# Altium schematic sheet PCB 1ST VERSION.SchDoc
size A3; SheetNumber: 1; SheetTotal: 1
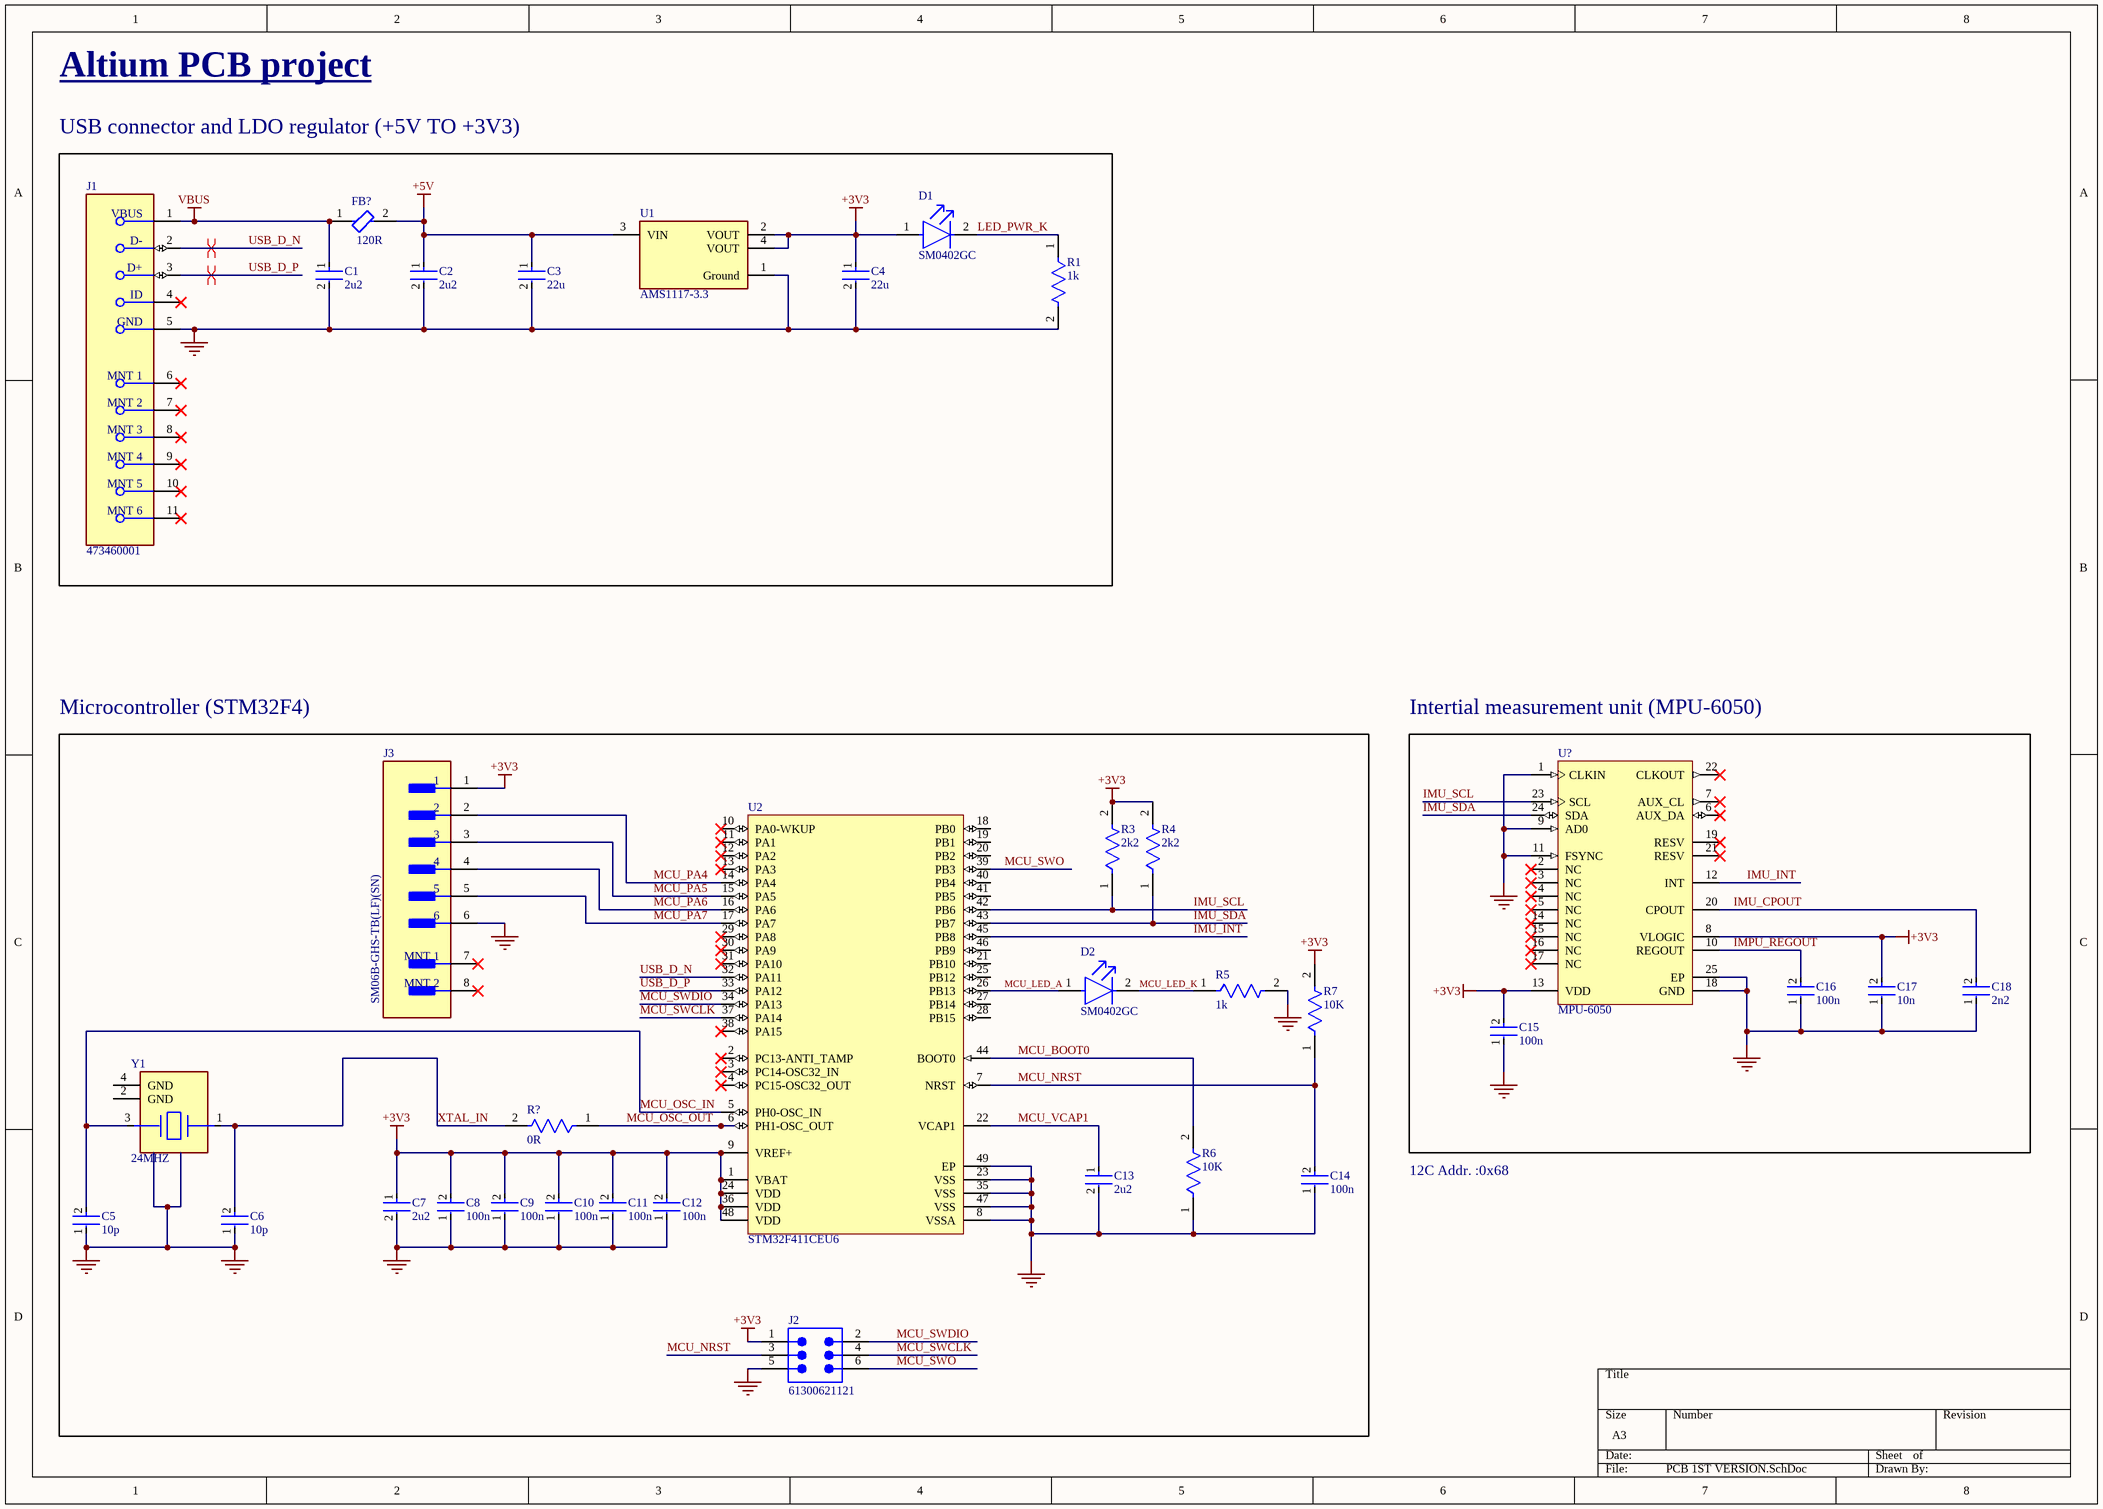
[diagram p0: PCB 1ST VERSION.SchDoc]

## Parts
C1  2u2  [FP-CC0603-DA-MFG]
C2  2u2  [FP-CC0603-DA-MFG]
C3  22u  [FP-CC0805-1_25-MFG]
C4  22u  [FP-CC0805-1_25-MFG]
C5  10p  [FP-CC0402-0_05-0_55-L2_0-MFG]
C6  10p  [FP-CC0402-0_05-0_55-L2_0-MFG]
C7  2u2  [FP-CC0603-DA-MFG]
C8  100n  [FP-CC0402-0_05-0_55-L2_0-MFG]
C9  100n  [FP-CC0402-0_05-0_55-L2_0-MFG]
C10  100n  [FP-CC0402-0_05-0_55-L2_0-MFG]
C11  100n  [FP-CC0402-0_05-0_55-L2_0-MFG]
C12  100n  [FP-CC0402-0_05-0_55-L2_0-MFG]
C13  2u2  [FP-CC0603-DA-MFG]
C14  100n  [FP-CC0402-0_05-0_55-L2_0-MFG]
C15  100n  [FP-CC0402-0_05-0_55-L2_0-MFG]
C16  100n  [FP-CC0402-0_05-0_55-L2_0-MFG]
C17  10n  [FP-CC0402-0_05-0_55-L2_0-MFG]
C18  2n2  [FP-CC0402-0_05-0_55-L2_0-MFG]
D1  SM0402GC  [FP-SM0402GC-MFG]
D2  SM0402GC  [FP-SM0402GC-MFG]
FB?  120R  [FP-BLM18-0_15-t0_8-IPC_A]
J1  473460001  [FP-473460001-MFG]
J2  61300621121  [61300621121]
J3  SM06B-GHS-TB(LF)(SN)  [FP-SM06B-GHS-TB_LF_SN-MFG]
R1  1k  [FP-AT0402-MFG]
R3  2k2  [FP-AT0402-MFG]
R4  2k2  [FP-AT0402-MFG]
R5  1k  [FP-AT0402-MFG]
R6  10K  [FP-CRGCQ0402-IPC_C]
R7  10K  [FP-CRGCQ0402-IPC_C]
R?  0R  [FP-CRGCQ0402-IPC_C]
U1  AMS1117-3.3  [FP-AMS1117-IPC_C]
U2  STM32F411CEU6  [STM-UFQFPN48_L]
U?  MPU-6050  [IS-QFN-24_V]
Y1  24MHZ  [FP-TSX-3225-MFG]

## Blocks framed on the sheet
USB connector and LDO regulator (+5V TO +3V3): C1-C4 D1 FB? J1 R1 U1
Microcontroller (STM32F4): C5-C14 D2 J2 J3 R3-R7 R? U2 Y1
Intertial measurement unit (MPU-6050): C15-C18 U?

## Nets
+3V3: C4.1 C7.1 C8.2 C9.2 C10.2 C11.2 C12.2 C15.2 C17.2 D1.1(A) J2.1 J3.1 R3.2 R4.2 R7.2 U1.2(VOUT) U1.4(VOUT) U2.1(VBAT) U2.9(VREF+) U2.24(VDD) U2.36(VDD) U2.48(VDD) U?.8(VLOGIC) U?.13(VDD)
+5V: C2.1 C3.1 FB?.2 U1.3(VIN)
GND: C1.2 C2.2 C3.2 C4.2 C5.1 C6.1 C7.2 C8.1 C9.1 C10.1 C11.1 C12.1 C13.2 C14.1 C15.1 C16.1 C17.1 C18.1 J1.5(GND) J2.5 J3.6 R1.2 R5.2 R6.1 U1.1(Ground) U2.8(VSSA) U2.23(VSS) U2.35(VSS) U2.47(VSS) U2.49(EP) U?.1(CLKIN) U?.9(AD0) U?.11(FSYNC) U?.18(GND) U?.25(EP)
VBUS: C1.1 FB?.1 J1.1(VBUS)
IMPU_REGOUT: C16.2 U?.10(REGOUT)
IMU_CPOUT: C18.2 U?.20(CPOUT)
IMU_INT: U2.45(PB8) U?.12(INT)
IMU_SCL: R3.1 U2.42(PB6) U?.23(SCL)
IMU_SDA: R4.1 U2.43(PB7) U?.24(SDA)
LED_PWR_K: D1.2(C) R1.1
MCU_BOOT0: R6.2 U2.44(BOOT0)
MCU_LED_A: D2.1(A) U2.26(PB13)
MCU_LED_K: D2.2(C) R5.1
MCU_NRST: C14.2 J2.3 R7.1 U2.7(NRST)
MCU_OSC_IN: C5.2 U2.5(PH0-OSC_IN) Y1.3
MCU_OSC_OUT: R?.1 U2.6(PH1-OSC_OUT)
MCU_PA4: J3.2 U2.14(PA4)
MCU_PA5: J3.3 U2.15(PA5)
MCU_PA6: J3.4 U2.16(PA6)
MCU_PA7: J3.5 U2.17(PA7)
MCU_SWCLK: J2.4 U2.37(PA14)
MCU_SWDIO: J2.2 U2.34(PA13)
MCU_SWO: J2.6 U2.39(PB3)
MCU_VCAP1: C13.1 U2.22(VCAP1)
USB_D_N: J1.2(D-) U2.32(PA11)
USB_D_P: J1.3(D+) U2.33(PA12)
XTAL_IN: C6.2 R?.2 Y1.1

Not connected (* = marked no-connect by the designer): J1 4(ID)* 6(MNT_1)* 7(MNT_2)* 8(MNT_3)* 9(MNT_4)* 10(MNT_5)* 11(MNT_6)*; J3 7(MNT_1)* 8(MNT_2)*; U2 2(PC13-ANTI_TAMP)* 3(PC14-OSC32_IN)* 4(PC15-OSC32_OUT)* 10(PA0-WKUP)* 11(PA1)* 12(PA2)* 13(PA3)* 18(PB0) 19(PB1) 20(PB2) 21(PB10) 25(PB12) 27(PB14) 28(PB15) 29(PA8)* 30(PA9)* 31(PA10)* 38(PA15)* 40(PB4) 41(PB5) 46(PB9); U? 2(NC)* 3(NC)* 4(NC)* 5(NC)* 6(AUX_DA)* 7(AUX_CL)* 14(NC)* 15(NC)* 16(NC)* 17(NC)* 19(RESV)* 21(RESV)* 22(CLKOUT)*; Y1 2(GND) 4(GND)

## Layout directives
differential pair; net class *; differential pair class DIFF_USB: USB_D_N, USB_D_P

## Notes on the sheet
- Altium PCB project
- 12C Addr. :0x68

## Library data of the parts
C1 C2 C7 C13 = CMP-03422-001147-1: CAP CER 0.1UF 16V X7R 0603; Manufacturer Part Number: CC0603MRX7R7BB104; Manufacturer: YAGEO; Temperature Coefficient: 15%; Material: Ceramic; Description: CC0603 100 nF X7R 20.00% 16 V; Tolerance: 0.2; Capacitance: 100 nF; Value: 100 nF; ComponentLink2Description: Datasheet; Device Class L3: Ceramic Capacitors; Mouser Description: Multilayer Ceramic Capacitors MLCC - SMD/SMT 100nF 16V X7R 20%; Package: CC0603-DA; Category: Cap; Lead Free: Yes; Height: 0.9mm; Device Class L1: Passive Components; Temperature Characteristic: X7R; Voltage: 16 V; Automotive: No; Device Class L2: Capacitors; Footprint Url: http://www.yageo.com/exep/pages/download/literatures/UPY-C_GEN_24.pdf; ComponentLink2URL: http://www.yageo.com/documents/recent/UPY-GPHC_X7R_6.3V-to-50V_18.pdf; Temperature Range Low: -55°C; Digikey Description: CAP CER 0.1UF 16V X7R 0603; RoHS: TRUE; Temperature Range High: +125°C; Octopart: https://octopart.com/cc0603mrx7r7bb104-yageo-12885115; Voltage Rating: 16 V; Temperature: -55°C to +125°C
C3 C4 = CMP-03422-000416-1: CAP CER 10UF 16V X5R 0805; Manufacturer: Yageo; Manufacturer Part Number: CC0805KKX5R7BB106; Temperature Coefficient: 15%; Material: Ceramic; Description: 10µF ±10% 16V Ceramic Capacitor X5R 0805 (2012 Metric); Tolerance: 10%; Device Class L3: Ceramic Capacitors; Height: 1.45mm; Value: 10uF; Device Class L1: Passive Components; Digikey Description: CAP CER 10UF 16V X5R 0805; Temperature: -55°C to +85°C; Category: Cap; Capacitance: 10uF; Footprint Url: https://www.yageo.com/upload/website/yageo_UPY-C_GEN_24_19050911_476.pdf; Octopart: https://octopart.com/cc0805kkx5r7bb106-yageo-11926151; ComponentLink2URL: https://www.yageo.com/upload/media/product/productsearch/datasheet/mlcc/UPY-GPHC_X5R_4V-to-50V_25.pdf; Device Class L2: Capacitors; Lead Free: Yes; Temperature Characteristic: X5R; Temperature Range High: +85°C; RoHS: TRUE; ComponentLink2Description: Datasheet; Voltage Rating: 16V; Ipc Land Pattern Name: CAPC200125X125; Temperature Range Low: -55°C; Automotive: No; Package: CC0805-1.25; Mouser Description: Multilayer Ceramic Capacitors MLCC - SMD/SMT 10uF 16V X5R 10%
C5 C6 C8-C12 C14-C18 = CMP-03422-001485-1: CAP CER 0.1UF 16V X7R 0402; Tolerance: 5%; Capacitance: 100nF; Lead Free: Lead Free; Halogen Free: Halogen Free; Voltage Rating (DC): 16V; Thickness: 0.022inch; Resistor Type: Ceramic; Min Operating Temperature: -55°C; Width: 0.02inch; Voltage Rating: 16V; Package Quantity: 10000; Case/Package: 0402; Height: 0.5mm; Dielectric: X7R; Length: 1mm; Construction: Flat; Radiation Hardening: No; Case Code (Metric): 1005; Case Code (Imperial): 0402; Series: CC; Depth: 0.5mm; RoHS Compliant: Yes; Packaging: Tape and Reel; Mount: Surface Mount; Max Operating Temperature: 125°C
D1 D2 = CMP-35283-000001-2: LED GREEN CLEAR 0402 SMD; Lens Size: 1mm; Luminous Intensity: 28.5mcd; Viewing Angle: 130°; Forward Voltage: 1.9V; Test Current: 20mA; Lens Color: Colorless; Lens Style: Flat; Dominant Wavelength: 572nm; Case Code (Metric): 1005; Mount: Surface Mount; Case Code (Imperial): 0402; Length: 1mm; Width: 0.5mm; Case/Package: 0402; Lens Transparency: Clear; Height: 0.71mm; Packaging: Tape and Reel; Color: Green
FB? = CMP-0686-00407-3: Chip Ferrite Bead, 0603, 600Ω @ 100MHz, 0.65Ω, 25%, 200mA; Impedance: 600R; Shielding: Unshielded; Resistance: 650mR; Number of Lines: 1; Material: Steel; Weight: 7.1E-05oz; Packaging: Tape and Reel; Case Code (Imperial): 0603; Case Code (Metric): 1608; Height: 0.8mm; REACH SVHC: No SVHC; Termination: SMD/SMT; Case/Package: 0603; Core Material: Ferrite; Tolerance: 25%; Depth: 0.8mm; Min Operating Temperature: -55°C; DC Resistance-Max: 650mR; Current Rating: 200mA; Package Quantity: 1; Lead Free: Lead Free; Series: BLM18B; DC Current: 200mA; Max Operating Temperature: 125°C; Radiation Hardening: No; Width: 0.8mm; Max Current Rating: 200mA; DC Resistance (DCR): 650mR; RoHS Compliant: Yes; Frequency: 100MHz; Length: 1.6mm; Number of Circuits: 1; Test Frequency: 100MHz; Number of Pins: 2; Military Standard: Not; Max DC Current: 200mA
J1 = CMP-2000-05246-2: CONN RCPT USB2.0 MICRO B SMD R/A; Manufacturer: Molex; Conn Orientation: Right Angle; Is Female: yes; Shielding: true; Pitch: 0.65mm; Number Of Contacts: 5; Description: USB - micro B USB 2.0 Receptacle Connector 5 Position Surface Mount, Right Angle; Voltage Rating: 30V; Current Rating: 1.8A; Device Class L2: USB Connectors; Digikey Description: CONN RCPT USB2.0 MICRO B SMD R/A; Height: 2.945mm; RoHS: TRUE; ComponentLink2Description: Datasheet; Octopart: https://octopart.com/47346-0001-molex-7164928; Automotive: No; Package: 0; Category: Conn; Device Class L1: Connectors; Usb Standard: USB 2.0; Temperature: -30°C to +85°C; Temperature Range Low: -30°C; Footprint Url: https://www.molex.com/pdm_docs/sd/473460001_sd.pdf; ComponentLink2URL: https://www.molex.com/webdocs/datasheets/pdf/en-us/0473460001_IO_CONNECTORS.pdf; Lead Free: Yes; Manufacturer Part Number: 473460001; Contact Material: Gold,Nickel; Temperature Range High: +85°C; Device Class L3: unset
J2 = CMP-1502-01072-4: THT Vertical Pin Header WR-PHD, Pitch 2.54 mm, Dual Row, 6 pins; Voltage Rating: 250V; Contact Resistance: 20mΩ; Gender: Male; Number of Positions: 6; Connector Type: Male Pin; Current Rating: 3A; Row Spacing: 2.54mm; Number of Pins: 6; Min Operating Temperature: -40°C; Termination: Solder; Height: 8.89mm; Number of Rows: 2; Lead Pitch: 2.54mm; Packaging: Bulk; RoHS: Compliant; Operating Supply Voltage: 250V; Number of Contacts: 6; Color: Black; Mount: Through Hole; Orientation: Vertical; Max Operating Temperature: 105°C; Pitch: 2.54mm; Contact Mating Length: 5.9944mm; Contact Plating: Gold; Contact Material: Gold
J3 = CMP-17439-000061-1: CONN HEADER SMD R/A 6POS 1.25MM; Number of Contacts: 6; Voltage Rating: 50V; Current Rating: 1A; Connector Type: Outer Shroud Contact; Contact Resistance: 50mR; Orientation: Right Angle; Max Operating Temperature: 85°C; Mount: Surface Mount; Packaging: Tape and Reel; Contact Plating: Tin; Depth: 4.05mm; Max Voltage Rating (AC): 50V; Lead Free: Lead Free; Pitch: 1.25mm; Number of Positions: 6; Max Current Rating: 1A; Termination: Solder; Min Operating Temperature: -25°C; Housing Color: Beige; Fastening Type: Ramp; Length: 10.75mm; Color: Natural; Contact Material: Bronze; Housing Material: Polyamide; Number of Rows: 1
R1 R3-R5 = CMP-03412-049230-1: Thin Film Chip Resistors Automotive Grade 1kΩ 1% 25ppm/°C 0402
R6 R7 R? = CMP-03211-011107-1: CRGCQ 0402 10K 1%; Manufacturer: TE Connectivity; Manufacturer Part Number: CRGCQ0402F10K; Value: 10KΩ; Voltage Rating: 50V; Tolerance: 0.01; Temperature Coefficient: ±100ppm/°C; Power Rating: 0.0625W; Description: CRGCQ0402 10KΩ 1% ±100ppm/°C 50V; Ipc Land Pattern Name: RESC10050X35; Ambient Temperature Range High: +70°C; Mouser Description: Res Thick Film 0402 10K Ohm 1% 0.063W(1/16W) ±100ppm/C Pad SMD Automotive T/R; Category: Res; Temperature Range High: +155°C; Lead Free: Yes; Device Class L1: Passive Components; ComponentLink2Description: Datasheet; Composition: Thick Film; Octopart: https://octopart.com/crgcq0402f10k-te+connectivity-91017932; ComponentLink2URL: https://www.te.com/commerce/DocumentDelivery/DDEController?Action=showdoc&DocId=Data+Sheet%7F1773204-3%7F1%7Fpdf%7FEnglish%7FENG_DS_1773204-3_1.pdf%7F4-2176347-922; Device Class L3: Chip SMD Resistors; Automotive: Yes; RoHS: TRUE; Digikey Description: CRGCQ 0402 10K 1%; Device Class L2: Resistors; Temperature: -55°C to +155°C; Series: CRGCQ; Height: 0.4mm; Package: CRGCQ0402; Temperature Range Low: -55°C; Resistance: 10KΩ
U1 = CMP-209535-000001-1: LDO Voltage Regulators 1A, 3.3V; Manufacturer: Advanced Monolithic Systems; Dropout Voltage: 1.1V; Output Type: Fixed; Nominal Supply Current: 5mA; Max Power Dissipation: 1.2W; Max Supply Voltage: 15V; Number Of Outputs: 1; Standoff Height: 0.64mm; Max Junction Temp: +125°C; Height: 1.8mm; Package: AMS1117; Device Class L2: Power Management ICs; ComponentLink2Description: Datasheet; ComponentLink2URL: http://www.advanced-monolithic.com/pdf/ds1117.pdf; Category: IC; RoHS: TRUE; Automotive: No; Device Class L1: Integrated Circuits (ICs); Output Current: 1A; Device Class L3: Voltage Regulators - Linear; Temperature: -40°C to +125°C; Output Voltage: 3.3V; Manufacturer Part Number: AMS1117-3.3; Temperature Range Low: -40°C; Octopart: https://octopart.com/ams1117-3.3-advanced+monolithic+systems-25899300; Lead Free: Yes; Ipc Land Pattern Name: SOT229P700X180-4; Temperature Range High: +125°C
U2 = CMP-0243-00165-1: ARM Cortex-M4 32-bit MCU+FPU, 512 KB Flash, 128 KB RAM, 36 I/Os, 48-Pin UFQFPN, -40 to 85 degC, Tray; Operating Frequency(F) (Processor speed) (MHz): 100; FLASH Size (Prog) (kB): 512; Internal RAM Size (kB): 128; I/Os (High Current): 36; Supply Voltage(Vcc) min (V): 1.7; Package Reference: 48-Pin Ultra Thin Fine Pitch Quad Flat No-Lead, 7 x 7 x 0.6 mm Body, 0.5 mm Pitch, Exposed Pad; ComponentLink1Description: Manufacturer URL; ComponentLink1URL: http://www.st.com/; Packing: Tray; Package Description: UFQFPN48; Core: ARM Cortex-M4; ComponentLink2Description: Datasheet; ComponentLink2URL: http://www.st.com/st-web-ui/static/active/en/resource/technical/document/datasheet/DM00115249.pdf; DatasheetVersion: Rev. 6; Mounting Technology: Surface Mount
U? = CMP-1753-00002-2: 3-Axis Gyroscope, Accelerometer and a Digital Motion Processor(TM) (DMP), 2.375 to 3.46 V, -40 to 85 degC, 24-Pin QFN, RoHS, Tape and Reel; Manufacturer: InvenSense; Featured Product: MPU-60506-Axis,IntegratedI²CSolution; Other Names: 1428-1007-2 / MPU6050; Sensor Type: MotionTracking; Online Catalog: MPU-6000™Series; Unit PriceUSD: Digital; Datasheet Version: Rev. 3.3, 05/2012; Category: Sensors,Transducers; Datasheet URL: http://datasheet.octopart.com/MPU-6050-InvenSense-datasheet-14421344.pdf; Family: Multifunction; Standard Package: 5,000; Manufacturer URL: http://www.invensense.com/; Output Type: Digital; Dynamic Catalog: MPU-6000™Series
Y1 = CMP-36405-000018-1: CRYSTAL 24.0000MHZ 9PF SMD; ESR (Equivalent Series Resistance): 40R; Frequency Stability: 20ppm; Tolerance: 10ppm; Drive Level: 200uW; Min Operating Temperature: -40°C; RoHS Compliant: Yes; Width: 2.5mm; Max Operating Temperature: 105°C; Package Quantity: 250; Load Capacitance: 9pF; Mount: Surface Mount; Lead Free: Lead Free; Height: 0.024inch; Depth: 2.5mm; Frequency: 24MHz; Packaging: Tape and Reel; Series: TSX-3225; Weight: 0.000564oz; Number of Pins: 4; Termination: SMD/SMT; Case/Package: SMD/SMT; Length: 3.2mm; Frequency Tolerance: 10ppm